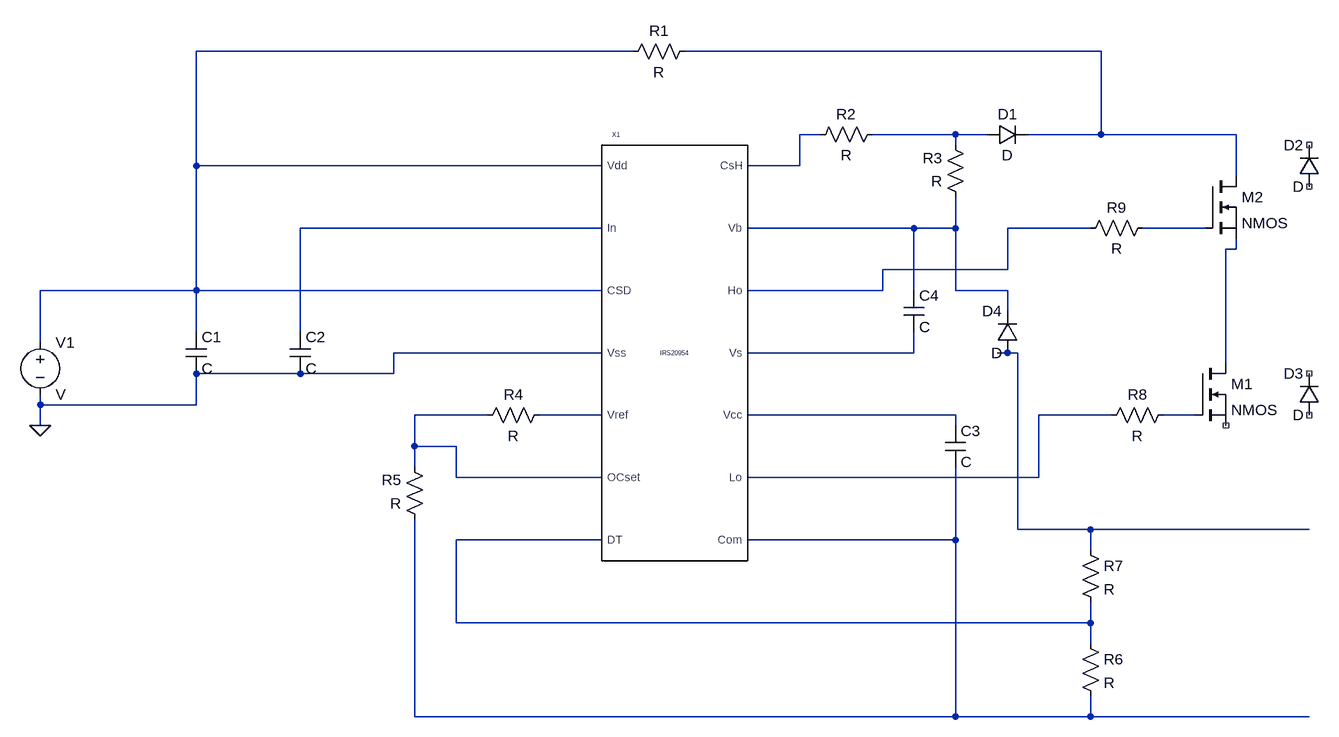
[diagram p0: schematic CLASE_D.asc]
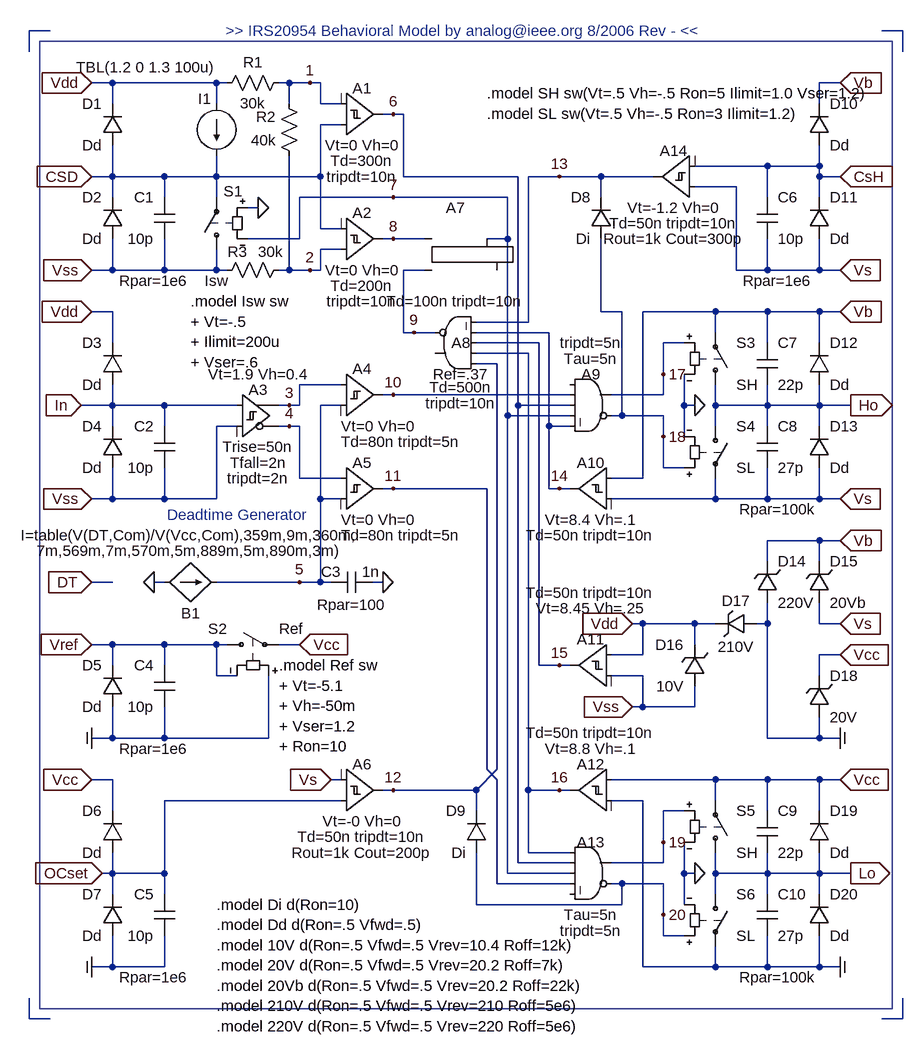
[diagram p1: sub-circuit irs20954.asc]
CLASE_D.asc, the LTspice schematic file:
Version 4
SHEET 1 1140 680
WIRE 80 -512 -592 -512
WIRE 800 -512 160 -512
WIRE 368 -384 336 -384
WIRE 576 -384 448 -384
WIRE 624 -384 576 -384
WIRE 800 -384 800 -512
WIRE 800 -384 688 -384
WIRE 1008 -384 800 -384
WIRE 576 -368 576 -384
WIRE -592 -336 -592 -512
WIRE 32 -336 -592 -336
WIRE 336 -336 336 -384
WIRE 336 -336 256 -336
WIRE 1008 -320 1008 -384
WIRE 32 -240 -432 -240
WIRE 512 -240 256 -240
WIRE 576 -240 576 -288
WIRE 576 -240 512 -240
WIRE 784 -240 656 -240
WIRE 960 -240 864 -240
WIRE 1008 -208 1008 -224
WIRE 1008 -208 992 -208
WIRE 656 -176 656 -240
WIRE 656 -176 464 -176
WIRE -592 -144 -592 -336
WIRE -592 -144 -832 -144
WIRE 32 -144 -592 -144
WIRE 464 -144 464 -176
WIRE 464 -144 256 -144
WIRE 512 -144 512 -240
WIRE 576 -144 576 -240
WIRE 656 -144 576 -144
WIRE 656 -112 656 -144
WIRE -592 -80 -592 -144
WIRE -432 -80 -432 -240
WIRE -832 -64 -832 -144
WIRE 32 -48 -288 -48
WIRE 512 -48 512 -80
WIRE 512 -48 256 -48
WIRE 656 -48 640 -48
WIRE 672 -48 656 -48
WIRE 992 -32 992 -208
WIRE -432 -16 -592 -16
WIRE -288 -16 -288 -48
WIRE -288 -16 -432 -16
WIRE -832 32 -832 16
WIRE -592 32 -592 -16
WIRE -592 32 -832 32
WIRE -144 48 -256 48
WIRE 32 48 -64 48
WIRE 576 48 256 48
WIRE 816 48 704 48
WIRE 944 48 896 48
WIRE -832 64 -832 32
WIRE 576 64 576 48
WIRE -256 96 -256 48
WIRE -192 96 -256 96
WIRE -256 128 -256 96
WIRE -192 144 -192 96
WIRE 32 144 -192 144
WIRE 704 144 704 48
WIRE 704 144 256 144
WIRE 672 224 672 -48
WIRE 784 224 672 224
WIRE 1120 224 784 224
WIRE 32 240 -192 240
WIRE 576 240 576 128
WIRE 576 240 256 240
WIRE 784 256 784 224
WIRE -192 368 -192 240
WIRE 784 368 784 336
WIRE 784 368 -192 368
WIRE 784 400 784 368
WIRE -256 512 -256 208
WIRE 576 512 576 240
WIRE 576 512 -256 512
WIRE 784 512 784 480
WIRE 784 512 576 512
WIRE 1120 512 784 512
FLAG -832 64 0
SYMBOL AutoGenerated\\IRS20954 144 -48 R0
SYMATTR InstName X1
SYMBOL voltage -832 -80 R0
SYMATTR InstName V1
SYMBOL cap -608 -80 R0
SYMATTR InstName C1
SYMBOL cap -448 -80 R0
SYMATTR InstName C2
SYMBOL cap 560 64 R0
SYMATTR InstName C3
SYMBOL cap 496 -144 R0
SYMATTR InstName C4
SYMBOL res 176 -528 R90
WINDOW 0 0 56 VBottom 2
WINDOW 3 32 56 VTop 2
SYMATTR InstName R1
SYMBOL res 464 -400 R90
WINDOW 0 0 56 VBottom 2
WINDOW 3 32 56 VTop 2
SYMATTR InstName R2
SYMBOL res 592 -272 R180
WINDOW 0 36 76 Left 2
WINDOW 3 36 40 Left 2
SYMATTR InstName R3
SYMBOL diode 624 -368 R270
WINDOW 0 32 32 VTop 2
WINDOW 3 0 32 VBottom 2
SYMATTR InstName D1
SYMBOL diode 1136 -304 R180
WINDOW 0 24 64 Left 2
WINDOW 3 24 0 Left 2
SYMATTR InstName D2
SYMBOL diode 1136 48 R180
WINDOW 0 24 64 Left 2
WINDOW 3 24 0 Left 2
SYMATTR InstName D3
SYMBOL res -48 32 R90
WINDOW 0 0 56 VBottom 2
WINDOW 3 32 56 VTop 2
SYMATTR InstName R4
SYMBOL res -240 224 R180
WINDOW 0 36 76 Left 2
WINDOW 3 36 40 Left 2
SYMATTR InstName R5
SYMBOL res 768 384 R0
SYMATTR InstName R6
SYMBOL res 768 240 R0
SYMATTR InstName R7
SYMBOL nmos 944 -32 R0
SYMATTR InstName M1
SYMBOL nmos 960 -320 R0
SYMATTR InstName M2
SYMBOL res 912 32 R90
WINDOW 0 0 56 VBottom 2
WINDOW 3 32 56 VTop 2
SYMATTR InstName R8
SYMBOL res 880 -256 R90
WINDOW 0 0 56 VBottom 2
WINDOW 3 32 56 VTop 2
SYMATTR InstName R9
SYMBOL diode 672 -48 R180
WINDOW 0 24 64 Left 2
WINDOW 3 24 0 Left 2
SYMATTR InstName D4

irs20954.asc, the sub-circuit schematic file:
Version 4
SHEET 1 13828 1048
WIRE -480 -576 -512 -576
WIRE 832 -576 800 -576
WIRE -512 -544 -512 -576
WIRE 832 -544 832 -576
WIRE -384 -496 -416 -496
WIRE -224 -496 -384 -496
WIRE -208 -496 -224 -496
WIRE -112 -496 -128 -496
WIRE -80 -496 -112 -496
WIRE -64 -496 -80 -496
WIRE 736 -496 704 -496
WIRE -384 -464 -384 -496
WIRE -224 -464 -224 -496
WIRE -112 -464 -112 -496
WIRE -64 -464 -64 -496
WIRE -32 -464 -64 -464
WIRE 704 -464 704 -496
WIRE 48 -448 32 -448
WIRE 64 -448 48 -448
WIRE -32 -432 -64 -432
WIRE 624 -368 512 -368
WIRE 704 -368 704 -400
WIRE 704 -368 624 -368
WIRE -384 -352 -384 -400
WIRE -384 -352 -416 -352
WIRE -304 -352 -384 -352
WIRE -224 -352 -224 -384
WIRE -224 -352 -304 -352
WIRE -64 -352 -64 -432
WIRE -64 -352 -224 -352
WIRE 64 -352 64 -448
WIRE 240 -352 64 -352
WIRE 304 -352 256 -352
WIRE 368 -352 304 -352
WIRE 448 -352 368 -352
WIRE 704 -352 704 -368
WIRE 736 -352 704 -352
WIRE 576 -336 512 -336
WIRE -384 -320 -384 -352
WIRE -304 -320 -304 -352
WIRE -224 -320 -224 -352
WIRE 48 -320 -96 -320
WIRE 224 -320 48 -320
WIRE 368 -320 368 -352
WIRE 624 -320 624 -368
WIRE 704 -320 704 -352
WIRE -160 -304 -176 -304
WIRE -64 -272 -64 -352
WIRE -32 -272 -64 -272
WIRE -96 -256 -96 -320
WIRE -96 -256 -176 -256
WIRE 48 -256 32 -256
WIRE 96 -256 48 -256
WIRE 224 -256 224 -320
WIRE 224 -256 192 -256
WIRE -32 -240 -64 -240
WIRE -384 -208 -384 -256
WIRE -384 -208 -416 -208
WIRE -304 -208 -304 -256
WIRE -304 -208 -384 -208
WIRE -224 -208 -224 -240
WIRE -224 -208 -304 -208
WIRE -208 -208 -224 -208
WIRE -112 -208 -112 -384
WIRE -112 -208 -128 -208
WIRE -80 -208 -112 -208
WIRE -64 -208 -64 -240
WIRE -64 -208 -80 -208
WIRE 96 -208 64 -208
WIRE 576 -208 576 -336
WIRE 624 -208 624 -256
WIRE 624 -208 576 -208
WIRE 704 -208 704 -256
WIRE 704 -208 624 -208
WIRE 736 -208 704 -208
WIRE -384 -144 -416 -144
WIRE 368 -144 368 -256
WIRE 400 -144 368 -144
WIRE 544 -144 432 -144
WIRE 624 -144 544 -144
WIRE 704 -144 624 -144
WIRE 736 -144 704 -144
WIRE 256 -128 256 -352
WIRE 256 -128 176 -128
WIRE 64 -112 64 -208
WIRE 80 -112 64 -112
WIRE 112 -112 80 -112
WIRE 288 -112 176 -112
WIRE 544 -112 544 -144
WIRE -384 -96 -384 -144
WIRE 272 -96 176 -96
WIRE 496 -96 464 -96
WIRE 624 -96 624 -144
WIRE 704 -96 704 -144
WIRE 256 -80 176 -80
WIRE 208 -64 176 -64
WIRE 464 -48 464 -96
WIRE -32 -32 -96 -32
WIRE 48 -16 32 -16
WIRE 320 -16 48 -16
WIRE 464 -16 464 -48
WIRE 464 -16 384 -16
WIRE -384 0 -384 -32
WIRE -384 0 -432 0
WIRE -304 0 -384 0
WIRE -192 0 -304 0
WIRE -112 0 -128 0
WIRE -96 0 -96 -32
WIRE -96 0 -112 0
WIRE -32 0 -64 0
WIRE 240 0 240 -352
WIRE 320 0 240 0
WIRE 496 0 496 -48
WIRE 512 0 496 0
WIRE 544 0 544 -32
WIRE 624 0 624 -32
WIRE 624 0 544 0
WIRE 704 0 704 -32
WIRE 704 0 624 0
WIRE 752 0 704 0
WIRE 224 16 224 -256
WIRE 320 16 224 16
WIRE 400 16 400 -144
WIRE 400 16 384 16
WIRE 464 16 400 16
WIRE -384 32 -384 0
WIRE -304 32 -304 0
WIRE -192 32 -224 32
WIRE -112 32 -128 32
WIRE -96 32 -112 32
WIRE 288 32 288 -112
WIRE 320 32 288 32
WIRE 544 32 544 0
WIRE 624 32 624 0
WIRE 704 32 704 0
WIRE 464 48 464 16
WIRE 496 48 496 0
WIRE 464 96 464 48
WIRE 496 96 464 96
WIRE -96 112 -96 32
WIRE -32 112 -96 112
WIRE 432 112 432 -144
WIRE 432 112 384 112
WIRE 48 128 32 128
WIRE 192 128 48 128
WIRE 288 128 288 32
WIRE 304 128 288 128
WIRE 320 128 304 128
WIRE -384 144 -384 96
WIRE -384 144 -416 144
WIRE -304 144 -304 96
WIRE -304 144 -384 144
WIRE -224 144 -224 32
WIRE -224 144 -304 144
WIRE -64 144 -64 0
WIRE -32 144 -64 144
WIRE 544 144 544 112
WIRE 544 144 384 144
WIRE 624 144 624 96
WIRE 624 144 544 144
WIRE 704 144 704 96
WIRE 704 144 624 144
WIRE 736 144 704 144
WIRE 704 208 624 208
WIRE 736 208 704 208
WIRE 624 240 624 208
WIRE 704 240 704 208
WIRE -384 272 -416 272
WIRE -304 272 -320 272
WIRE -96 272 -224 272
WIRE -64 272 -64 144
WIRE -64 272 -96 272
WIRE -48 272 -64 272
WIRE 32 272 16 272
WIRE 432 336 416 336
WIRE 512 336 432 336
WIRE 544 336 512 336
WIRE 624 336 624 304
WIRE 624 336 608 336
WIRE 704 336 704 304
WIRE 736 336 704 336
WIRE -384 368 -416 368
WIRE -304 368 -384 368
WIRE -224 368 -304 368
WIRE -208 368 -224 368
WIRE -96 368 -128 368
WIRE 512 368 512 336
WIRE 432 384 432 336
WIRE 432 384 384 384
WIRE 736 384 704 384
WIRE -384 400 -384 368
WIRE -304 400 -304 368
WIRE 272 400 272 -96
WIRE 304 400 272 400
WIRE 320 400 304 400
WIRE -224 416 -224 368
WIRE -192 416 -224 416
WIRE 432 416 384 416
WIRE 704 416 704 384
WIRE 432 464 432 416
WIRE 432 464 416 464
WIRE 512 464 512 432
WIRE 512 464 432 464
WIRE -384 512 -384 464
WIRE -384 512 -416 512
WIRE -304 512 -304 464
WIRE -304 512 -384 512
WIRE -144 512 -144 416
WIRE -144 512 -304 512
WIRE 624 512 624 336
WIRE 704 512 704 480
WIRE 704 512 624 512
WIRE 736 512 704 512
WIRE 192 560 192 128
WIRE 208 560 208 -64
WIRE -384 576 -416 576
WIRE -32 576 -48 576
WIRE 208 576 192 560
WIRE 544 576 384 576
WIRE 624 576 544 576
WIRE 704 576 624 576
WIRE 736 576 704 576
WIRE 48 592 32 592
WIRE 176 592 208 560
WIRE 176 592 48 592
WIRE 256 592 256 -80
WIRE 304 592 256 592
WIRE 320 592 304 592
WIRE -32 608 -304 608
WIRE 432 608 384 608
WIRE 544 608 544 576
WIRE -384 624 -384 576
WIRE 176 624 176 592
WIRE 496 624 464 624
WIRE 624 624 624 576
WIRE 704 624 704 576
WIRE 464 672 464 624
WIRE 256 688 256 592
WIRE 320 688 256 688
WIRE 240 704 240 0
WIRE 320 704 240 704
WIRE 464 704 464 672
WIRE 464 704 384 704
WIRE -384 720 -384 688
WIRE -384 720 -400 720
WIRE -304 720 -304 608
WIRE -304 720 -384 720
WIRE 224 720 224 16
WIRE 320 720 224 720
WIRE 496 720 496 672
WIRE 512 720 496 720
WIRE 544 720 544 688
WIRE 624 720 624 688
WIRE 624 720 544 720
WIRE 704 720 704 688
WIRE 704 720 624 720
WIRE 752 720 704 720
WIRE 208 736 208 576
WIRE 320 736 208 736
WIRE 400 736 384 736
WIRE 464 736 400 736
WIRE -384 752 -384 720
WIRE -304 752 -304 720
WIRE 544 752 544 720
WIRE 624 752 624 720
WIRE 704 752 704 720
WIRE 176 768 176 688
WIRE 400 768 400 736
WIRE 400 768 176 768
WIRE 496 768 496 720
WIRE 464 784 464 736
WIRE 464 816 464 784
WIRE 496 816 464 816
WIRE -384 864 -384 816
WIRE -384 864 -416 864
WIRE -304 864 -304 816
WIRE -304 864 -384 864
WIRE 432 864 432 608
WIRE 544 864 544 832
WIRE 544 864 432 864
WIRE 624 864 624 816
WIRE 624 864 544 864
WIRE 704 864 704 816
WIRE 704 864 624 864
WIRE 736 864 704 864
WIRE -512 944 -512 912
WIRE -480 944 -512 944
WIRE 832 944 832 912
WIRE 832 944 800 944
FLAG 752 0 Ho
IOPIN 752 0 Out
FLAG -432 0 In
IOPIN -432 0 In
FLAG -416 -144 Vdd
IOPIN -416 -144 In
FLAG 736 -144 Vb
IOPIN 736 -144 In
FLAG 736 144 Vs
IOPIN 736 144 In
FLAG -416 144 Vss
IOPIN -416 144 In
FLAG 736 512 Com
IOPIN 736 512 In
FLAG 736 576 Vcc
IOPIN 736 576 In
FLAG 736 864 Com
IOPIN 736 864 In
FLAG 752 720 Lo
IOPIN 752 720 Out
FLAG -96 272 5
FLAG 512 720 0
FLAG 512 0 0
FLAG 80 -112 9
FLAG 464 -48 17
FLAG 464 48 18
FLAG 736 384 Vcc
IOPIN 736 384 In
FLAG 736 208 Vb
IOPIN 736 208 In
FLAG 736 336 Vs
IOPIN 736 336 In
FLAG -112 0 3
FLAG 304 -352 13
FLAG 304 128 14
FLAG -112 32 4
FLAG 48 -16 10
FLAG -400 720 OCset
IOPIN -400 720 In
FLAG 32 272 0
FLAG -320 272 0
FLAG -416 272 DT
IOPIN -416 272 In
FLAG 464 672 19
FLAG 464 784 20
FLAG 416 464 Vss
IOPIN 416 464 In
FLAG 416 336 Vdd
IOPIN 416 336 In
FLAG 736 -352 CsH
IOPIN 736 -352 In
FLAG 736 -496 Vb
IOPIN 736 -496 In
FLAG 736 -208 Vs
IOPIN 736 -208 In
FLAG -416 -352 CSD
IOPIN -416 -352 In
FLAG -416 -496 Vdd
IOPIN -416 -496 In
FLAG -416 -208 Vss
IOPIN -416 -208 In
FLAG -160 -304 0
FLAG -416 368 Vref
IOPIN -416 368 In
FLAG -48 576 Vs
IOPIN -48 576 In
FLAG -416 576 Vcc
IOPIN -416 576 In
FLAG -416 864 Com
IOPIN -416 864 In
FLAG -80 -496 1
FLAG -80 -208 2
FLAG 48 128 11
FLAG 48 -448 6
FLAG 48 -320 7
FLAG 48 -256 8
FLAG 48 592 12
FLAG 304 400 15
FLAG 304 592 16
FLAG -96 368 Vcc
IOPIN -96 368 In
FLAG -416 512 Com
IOPIN -416 512 In
SYMBOL diode -368 -400 R180
WINDOW 0 32 64 Left 0
WINDOW 3 32 0 Left 0
SYMATTR InstName D1
SYMATTR Value Dd
SYMBOL diode -368 -256 R180
WINDOW 0 32 64 Left 0
WINDOW 3 32 0 Left 0
SYMATTR InstName D2
SYMATTR Value Dd
SYMBOL cap -288 -320 M0
WINDOW 0 32 0 Left 0
WINDOW 3 32 64 Left 0
WINDOW 39 32 128 Center 0
SYMATTR InstName C1
SYMATTR Value 10p
SYMATTR SpiceLine Rpar=1e6
SYMBOL current -224 -464 R0
WINDOW 123 0 0 Left 0
WINDOW 39 0 0 Left 0
WINDOW 3 0 -56 Right 0
WINDOW 0 -8 -8 Right 0
SYMATTR Value TBL(1.2 0 1.3 100u)
SYMATTR InstName I1
SYMBOL sw -224 -224 R180
WINDOW 0 -11 105 Right 0
WINDOW 3 0 -32 Center 0
SYMATTR InstName S1
SYMATTR Value Isw
SYMBOL res -224 -480 R270
WINDOW 0 32 56 VTop 0
WINDOW 3 0 56 VBottom 0
SYMATTR InstName R1
SYMATTR Value 30k
SYMBOL res -96 -368 R180
WINDOW 0 36 76 Left 0
WINDOW 3 36 40 Left 0
SYMATTR InstName R2
SYMATTR Value 40k
SYMBOL res -112 -224 R90
WINDOW 0 -12 64 VRight 0
WINDOW 3 -12 48 VLeft 0
SYMATTR InstName R3
SYMATTR Value 30k
SYMBOL Digital\\diffschmtbuf -32 -384 M180
WINDOW 0 32 104 Center 0
WINDOW 3 32 16 Center 0
WINDOW 123 32 -8 Center 0
WINDOW 39 32 -32 Center 0
SYMATTR InstName A1
SYMATTR Value Vt=0 Vh=0
SYMATTR Value2 Td=300n
SYMATTR SpiceLine tripdt=10n
SYMBOL Digital\\diffschmtbuf -32 -192 M180
WINDOW 0 32 104 Center 0
WINDOW 3 32 16 Center 0
WINDOW 123 32 -8 Center 0
WINDOW 39 32 -32 Center 0
SYMATTR InstName A2
SYMATTR Value Vt=0 Vh=0
SYMATTR Value2 Td=200n
SYMATTR SpiceLine tripdt=10n
SYMBOL diode -368 -32 R180
WINDOW 0 32 64 Left 0
WINDOW 3 32 0 Left 0
SYMATTR InstName D3
SYMATTR Value Dd
SYMBOL diode -368 96 R180
WINDOW 0 32 64 Left 0
WINDOW 3 32 0 Left 0
SYMATTR InstName D4
SYMATTR Value Dd
SYMBOL cap -288 32 M0
WINDOW 0 32 0 Left 0
WINDOW 3 32 64 Left 0
SYMATTR InstName C2
SYMATTR Value 10p
SYMBOL Digital\\diffschmitt -192 -48 R0
WINDOW 0 32 24 Center 0
WINDOW 3 32 0 Center 0
WINDOW 123 32 112 Center 0
WINDOW 39 32 136 Center 0
WINDOW 40 32 160 Center 0
SYMATTR InstName A3
SYMATTR Value Vt=1.9 Vh=0.4
SYMATTR Value2 Trise=50n
SYMATTR SpiceLine Tfall=2n
SYMATTR SpiceLine2 tripdt=2n
SYMBOL Digital\\diffschmtbuf -32 -80 R0
WINDOW 0 32 24 Center 0
WINDOW 3 0 112 Left 0
WINDOW 123 0 136 Left 0
SYMATTR InstName A4
SYMATTR Value Vt=0 Vh=0
SYMATTR Value2 Td=80n tripdt=5n
SYMBOL Digital\\diffschmtbuf -32 64 R0
WINDOW 0 32 24 Center 0
WINDOW 3 0 112 Left 0
WINDOW 123 0 136 Left 0
SYMATTR InstName A5
SYMATTR Value Vt=0 Vh=0
SYMATTR Value2 Td=80n tripdt=5n
SYMBOL bi -304 272 R270
WINDOW 0 -48 40 VCenter 0
WINDOW 3 72 40 VCenter 0
WINDOW 123 48 40 VCenter 0
SYMATTR InstName B1
SYMATTR Value I=table(V(DT,Com)/V(Vcc,Com),359m,9m,360m,
SYMATTR Value2 7m,569m,7m,570m,5m,889m,5m,890m,3m)
SYMBOL cap -48 256 M90
WINDOW 0 0 16 VLeft 0
WINDOW 3 0 48 VRight 0
WINDOW 39 35 32 VTop 0
SYMATTR InstName C3
SYMATTR Value 1n
SYMATTR SpiceLine Rpar=100
SYMBOL sw -224 368 R270
WINDOW 0 24 16 VLeft 0
WINDOW 3 24 96 VRight 0
SYMATTR InstName S2
SYMATTR Value Ref
SYMBOL Digital\\diffschmtbuf -32 656 M180
WINDOW 0 32 104 Center 0
WINDOW 3 32 16 Center 0
WINDOW 123 32 -8 Center 0
WINDOW 39 32 -32 Center 0
SYMATTR InstName A6
SYMATTR Value Vt=-0 Vh=0
SYMATTR Value2 Td=50n tripdt=10n
SYMATTR SpiceLine Rout=1k Cout=200p
SYMBOL Digital\\srflop 144 -304 R0
WINDOW 0 0 0 Center 0
WINDOW 3 0 144 Center 0
SYMATTR InstName A7
SYMATTR Value Td=100n tripdt=10n
SYMBOL Digital\\and 144 -32 R180
WINDOW 0 -8 64 Center 0
WINDOW 3 -8 16 Center 0
WINDOW 123 -8 -4 Center 0
WINDOW 39 -8 -29 Center 0
SYMATTR InstName A8
SYMATTR Value Ref=.37
SYMATTR Value2 Td=500n
SYMATTR SpiceLine tripdt=10n
SYMBOL Digital\\and 352 -64 R0
WINDOW 0 0 16 Center 0
WINDOW 3 0 -8 Center 0
WINDOW 123 0 -32 Center 0
SYMATTR InstName A9
SYMATTR Value Tau=5n
SYMATTR Value2 tripdt=5n
SYMBOL Digital\\diffschmtbuf 384 64 M0
WINDOW 0 32 24 Center 0
WINDOW 3 32 112 Center 0
WINDOW 123 32 136 Center 0
SYMATTR InstName A10
SYMATTR Value Vt=8.4 Vh=.1
SYMATTR Value2 Td=50n tripdt=10n
SYMBOL Digital\\diffschmtbuf 384 336 M0
WINDOW 0 32 24 Center 0
WINDOW 3 32 -24 Center 0
WINDOW 123 32 -48 Center 0
SYMATTR InstName A11
SYMATTR Value Vt=8.45 Vh=.25
SYMATTR Value2 Td=50n tripdt=10n
SYMBOL Digital\\diffschmtbuf 384 528 M0
WINDOW 0 32 24 Center 0
WINDOW 3 32 0 Center 0
WINDOW 123 32 -24 Center 0
SYMATTR InstName A12
SYMATTR Value Vt=8.8 Vh=.1
SYMATTR Value2 Td=50n tripdt=10n
SYMBOL Digital\\and 352 656 R0
WINDOW 0 0 16 Center 0
WINDOW 3 0 128 Center 0
WINDOW 123 0 152 Center 0
SYMATTR InstName A13
SYMATTR Value Tau=5n
SYMATTR Value2 tripdt=5n
SYMBOL Digital\\diffschmtbuf 512 -288 R180
WINDOW 0 32 104 Center 0
WINDOW 3 32 16 Center 0
WINDOW 123 32 -8 Center 0
WINDOW 39 32 -32 Center 0
SYMATTR InstName A14
SYMATTR Value Vt=-1.2 Vh=0
SYMATTR Value2 Td=50n tripdt=10n
SYMATTR SpiceLine Rout=1k Cout=300p
SYMBOL sw 544 -16 M180
WINDOW 0 32 80 Left 0
WINDOW 3 32 16 Left 0
SYMATTR InstName S3
SYMATTR Value SH
SYMBOL sw 544 16 R0
WINDOW 0 32 16 Left 0
WINDOW 3 32 80 Left 0
SYMATTR InstName S4
SYMATTR Value SL
SYMBOL sw 544 704 M180
WINDOW 0 32 80 Left 0
WINDOW 3 32 16 Left 0
SYMATTR InstName S5
SYMATTR Value SH
SYMBOL sw 544 736 R0
WINDOW 0 32 16 Left 0
WINDOW 3 32 80 Left 0
SYMATTR InstName S6
SYMATTR Value SL
SYMBOL diode -368 464 R180
WINDOW 0 32 64 Left 0
WINDOW 3 32 0 Left 0
SYMATTR InstName D5
SYMATTR Value Dd
SYMBOL cap -288 400 M0
WINDOW 0 32 0 Left 0
WINDOW 3 32 64 Left 0
WINDOW 39 32 128 Center 0
SYMATTR InstName C4
SYMATTR Value 10p
SYMATTR SpiceLine Rpar=1e6
SYMBOL cap -288 752 M0
WINDOW 0 32 0 Left 0
WINDOW 3 32 64 Left 0
WINDOW 39 32 128 Center 0
SYMATTR InstName C5
SYMATTR Value 10p
SYMATTR SpiceLine Rpar=1e6
SYMBOL cap 608 -320 R0
WINDOW 0 32 0 Left 0
WINDOW 3 32 64 Left 0
WINDOW 39 32 128 Center 0
SYMATTR InstName C6
SYMATTR Value 10p
SYMATTR SpiceLine Rpar=1e6
SYMBOL cap 608 -96 R0
WINDOW 0 32 0 Left 0
WINDOW 3 32 64 Left 0
SYMATTR InstName C7
SYMATTR Value 22p
SYMBOL cap 608 32 R0
WINDOW 0 32 0 Left 0
WINDOW 3 32 64 Left 0
WINDOW 39 32 128 Center 0
SYMATTR InstName C8
SYMATTR Value 27p
SYMATTR SpiceLine Rpar=100k
SYMBOL cap 608 624 R0
WINDOW 0 32 0 Left 0
WINDOW 3 32 64 Left 0
SYMATTR InstName C9
SYMATTR Value 22p
SYMBOL cap 608 752 R0
WINDOW 0 32 0 Left 0
WINDOW 3 32 64 Left 0
WINDOW 39 32 128 Center 0
SYMATTR InstName C10
SYMATTR Value 27p
SYMATTR SpiceLine Rpar=100k
SYMBOL diode -368 688 R180
WINDOW 0 32 64 Left 0
WINDOW 3 32 0 Left 0
SYMATTR InstName D6
SYMATTR Value Dd
SYMBOL diode -368 816 R180
WINDOW 0 32 64 Left 0
WINDOW 3 32 0 Left 0
SYMATTR InstName D7
SYMATTR Value Dd
SYMBOL diode 384 -256 R180
WINDOW 0 32 64 Left 0
WINDOW 3 32 0 Left 0
SYMATTR InstName D8
SYMATTR Value Di
SYMBOL diode 192 688 R180
WINDOW 0 32 64 Left 0
WINDOW 3 32 0 Left 0
SYMATTR InstName D9
SYMATTR Value Di
SYMBOL diode 688 -400 M180
WINDOW 0 32 64 Left 0
WINDOW 3 32 0 Left 0
SYMATTR InstName D10
SYMATTR Value Dd
SYMBOL diode 688 -256 M180
WINDOW 0 32 64 Left 0
WINDOW 3 32 0 Left 0
SYMATTR InstName D11
SYMATTR Value Dd
SYMBOL diode 688 -32 M180
WINDOW 0 32 64 Left 0
WINDOW 3 32 0 Left 0
SYMATTR InstName D12
SYMATTR Value Dd
SYMBOL diode 688 96 M180
WINDOW 0 32 64 Left 0
WINDOW 3 32 0 Left 0
SYMATTR InstName D13
SYMATTR Value Dd
SYMBOL zener 640 304 R180
WINDOW 0 0 64 Right 0
WINDOW 3 0 0 Right 0
SYMATTR InstName D14
SYMATTR Value 220V
SYMBOL zener 720 304 R180
WINDOW 0 0 64 Right 0
WINDOW 3 0 0 Right 0
SYMATTR InstName D15
SYMATTR Value 20Vb
SYMBOL zener 528 432 R180
WINDOW 0 32 64 Left 0
WINDOW 3 32 0 Left 0
SYMATTR InstName D16
SYMATTR Value 10V
SYMBOL zener 608 352 M270
WINDOW 0 36 32 VTop 0
WINDOW 3 -4 32 VBottom 0
SYMATTR InstName D17
SYMATTR Value 210V
SYMBOL zener 720 480 R180
WINDOW 0 0 64 Right 0
WINDOW 3 0 0 Right 0
SYMATTR InstName D18
SYMATTR Value 20V
SYMBOL diode 688 688 M180
WINDOW 0 32 64 Left 0
WINDOW 3 32 0 Left 0
SYMATTR InstName D19
SYMATTR Value Dd
SYMBOL diode 688 816 M180
WINDOW 0 32 64 Left 0
WINDOW 3 32 0 Left 0
SYMATTR InstName D20
SYMATTR Value Dd
TEXT 160 -576 Center 0 ;>> IRS20954 Behavioral Model by analog@ieee.org 8/2006 Rev - <<
TEXT -224 768 Left 0 !.model Di d(Ron=10)\n.model Dd d(Ron=.5 Vfwd=.5)\n.model 10V d(Ron=.5 Vfwd=.5 Vrev=10.4 Roff=12k)\n.model 20V d(Ron=.5 Vfwd=.5 Vrev=20.2 Roff=7k)\n.model 20Vb d(Ron=.5 Vfwd=.5 Vrev=20.2 Roff=22k)\n.model 210V d(Ron=.5 Vfwd=.5 Vrev=210 Roff=5e6)\n.model 220V d(Ron=.5 Vfwd=.5 Vrev=220 Roff=5e6)
TEXT 192 -480 Left 0 !.model SH sw(Vt=.5 Vh=-.5 Ron=5 Ilimit=1.0 Vser=1.2)\n.model SL sw(Vt=.5 Vh=-.5 Ron=3 Ilimit=1.2)
TEXT -264 -160 Left 0 !.model Isw sw\n+ Vt=-.5\n+ Ilimit=200u\n+ Vser=.6
TEXT -128 400 Left 0 !.model Ref sw\n+ Vt=-5.1\n+ Vh=-50m\n+ Vser=1.2\n+ Ron=10
TEXT -80 168 Right 0 ;Deadtime Generator
RECTANGLE Normal 816 928 -496 -560

The netlist it stands for:
* CLASE_D.asc
XX1 N001 N005 N001 0 N013 N012 N017 N018 N015 N014 N010 N007 N006 N003 irs20954 params: IRS20954
V1 N001 0 V
C1 N001 0 C
C2 N005 0 C
C3 N014 N018 C
C4 N006 N010 C
R1 N002 N001 R
R2 N004 N003 R
R3 N006 N004 R
D1 N004 N002 D
D2 NC_01 NC_02 D
D3 NC_03 NC_04 D
R4 N013 N012 R
R5 N018 N012 R
R6 N017 N018 R
R7 N011 N017 R
M1 N009 N016 NC_05 NC_05 NMOS
M2 N002 N008 N009 N009 NMOS
R8 N016 N015 R
R9 N008 N007 R
D4 N011 N006 D

* block symbol definitions
.subckt irs20954 Vdd In CSD Vss Vref OCset DT Com Lo Vcc Vs Ho Vb CsH
D1 CSD Vdd Dd
D2 Vss CSD Dd
C1 CSD Vss 10p Rpar=1e6
I1 Vdd CSD TBL(1.2 0 1.3 100u)
S1 Vss CSD 0 7 Isw
R1 Vdd 1 30k
R2 2 1 40k
R3 2 Vss 30k
A1 CSD 1 0 0 0 0 6 0 SCHMITT Vt=0 Vh=0 Td=300n tripdt=10n
A2 2 CSD 0 0 0 0 8 0 SCHMITT Vt=0 Vh=0 Td=200n tripdt=10n
D3 In Vdd Dd
D4 Vss In Dd
C2 In Vss 10p
A3 In Vss 0 0 0 4 3 0 SCHMITT Vt=1.9 Vh=0.4 Trise=50n Tfall=2n tripdt=2n
A4 3 5 0 0 0 0 10 0 SCHMITT Vt=0 Vh=0 Td=80n tripdt=5n
A5 4 5 0 0 0 0 11 0 SCHMITT Vt=0 Vh=0 Td=80n tripdt=5n
B1 0 5 I=table(V(DT,Com)/V(Vcc,Com),359m,9m,360m, 7m,569m,7m,570m,5m,889m,5m,890m,3m)
C3 5 0 1n Rpar=100
S2 Vref Vcc Com Vref Ref
A6 OCset Vs 0 0 0 0 12 0 SCHMITT Vt=-0 Vh=0 Td=50n tripdt=10n Rout=1k Cout=200p
A7 8 9 0 0 0 0 7 0 SRFLOP Td=100n tripdt=10n
A8 12 16 15 14 13 9 0 0 AND Ref=.37 Td=500n tripdt=10n
A9 0 10 6 7 14 18 17 0 AND Tau=5n tripdt=5n
A10 Vb Vs 0 0 0 0 14 0 SCHMITT Vt=8.4 Vh=.1 Td=50n tripdt=10n
A11 Vdd Vss 0 0 0 0 15 0 SCHMITT Vt=8.45 Vh=.25 Td=50n tripdt=10n
A12 Vcc Com 0 0 0 0 16 0 SCHMITT Vt=8.8 Vh=.1 Td=50n tripdt=10n
A13 16 6 7 11 0 20 19 0 AND Tau=5n tripdt=5n
A14 Vs CsH 0 0 0 0 13 0 SCHMITT Vt=-1.2 Vh=0 Td=50n tripdt=10n Rout=1k Cout=300p
S3 Ho Vb 17 0 SH
S4 Ho Vs 18 0 SL
S5 Lo Vcc 19 0 SH
S6 Lo Com 20 0 SL
D5 Com Vref Dd
C4 Vref Com 10p Rpar=1e6
C5 OCset Com 10p Rpar=1e6
C6 CsH Vs 10p Rpar=1e6
C7 Vb Ho 22p
C8 Ho Vs 27p Rpar=100k
C9 Vcc Lo 22p
C10 Lo Com 27p Rpar=100k
D6 OCset Vcc Dd
D7 Com OCset Dd
D8 18 13 Di
D9 20 12 Di
D10 CsH Vb Dd
D11 Vs CsH Dd
D12 Ho Vb Dd
D13 Vs Ho Dd
D14 Com Vb 220V
D15 Vs Vb 20Vb
D16 Vss Vdd 10V
D17 Com Vdd 210V
D18 Com Vcc 20V
D19 Lo Vcc Dd
D20 Com Lo Dd
* >> IRS20954 Behavioral Model by analog@ieee.org 8/2006 Rev - <<
.model Di d(Ron=10)
.model Dd d(Ron=.5 Vfwd=.5)
.model 10V d(Ron=.5 Vfwd=.5 Vrev=10.4 Roff=12k)
.model 20V d(Ron=.5 Vfwd=.5 Vrev=20.2 Roff=7k)
.model 20Vb d(Ron=.5 Vfwd=.5 Vrev=20.2 Roff=22k)
.model 210V d(Ron=.5 Vfwd=.5 Vrev=210 Roff=5e6)
.model 220V d(Ron=.5 Vfwd=.5 Vrev=220 Roff=5e6)
.model SH sw(Vt=.5 Vh=-.5 Ron=5 Ilimit=1.0 Vser=1.2)
.model SL sw(Vt=.5 Vh=-.5 Ron=3 Ilimit=1.2)
.model Isw sw
+ Vt=-.5
+ Ilimit=200u
+ Vser=.6
.model Ref sw
+ Vt=-5.1
+ Vh=-50m
+ Vser=1.2
+ Ron=10
* Deadtime Generator
.ends irs20954

.model D D
.lib standard.dio
.model NMOS NMOS
.model PMOS PMOS
.lib standard.mos
.backanno
.end